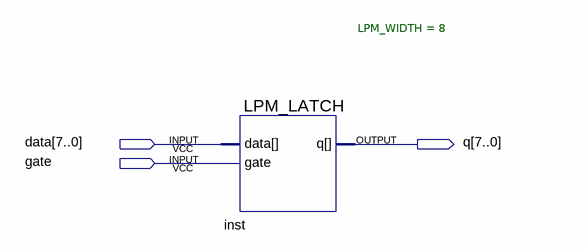
[diagram p0: schematic sheet]
// Quartus schematic Latc.bdf as structural Verilog: 1 symbols, 3 pins
module Latc (
  input  [7:0] data,
  input  gate,
  output [7:0] q
);

  LPM_LATCH #(.LPM_WIDTH(8)) inst (.data(data), .gate(gate), .q(q));
endmodule
